# EAGLE design BrushTimer (EAGLE 6.1)
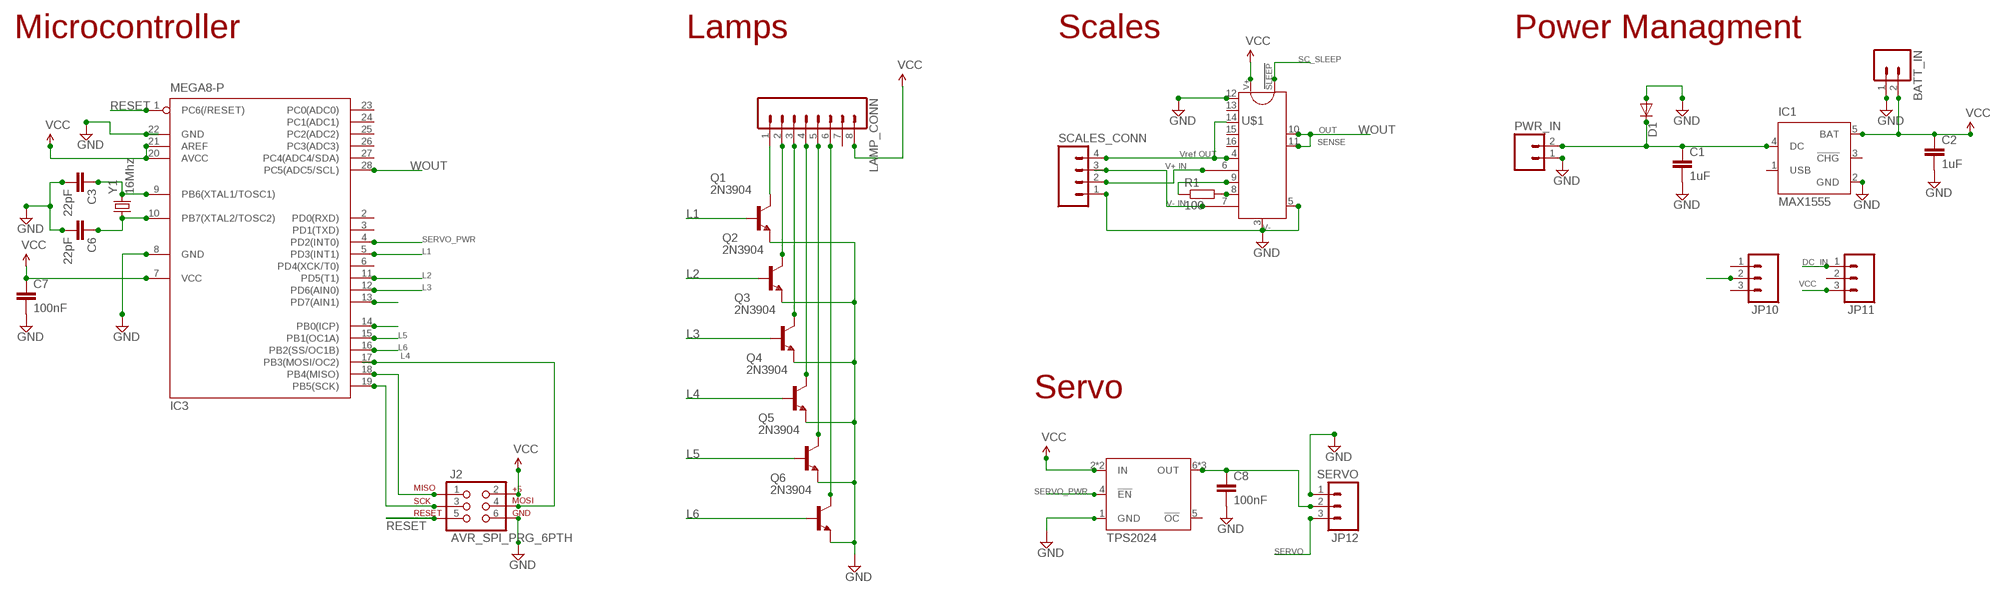
[diagram p0: schematic, sheet 1]

## Parts
BATT_IN  M02PTH  [1X02]
C1  1uF  CAP_  [AXIAL-5MM]
C2  1uF  CAP_  [AXIAL-5MM]
C3  22pF  C2.5/2  [C2.5-2]
C6  22pF  C2.5/2  [C2.5-2]
C7  100nF  C5/3.5  [C5B3.5]
C8  100nF  C5/3.5  [C5B3.5]
D1  DIODE-D-2.5  [D-2.5]
IC1  MAX1555  [SOT23-5L]
IC3  MEGA8-P  [DIL28-3]
J2  AVR_SPI_PRG_6PTH  [2X3]
JP10  M03PTH  [1X03]
JP11  M03PTH  [1X03]
JP12  SERVO  M03PTH  [1X03]
LAMP_CONN  M081X08  [1X08]
PWR_IN  M02PTH  [1X02]
Q1  2N3904  [TO92]
Q2  2N3904  [TO92]
Q3  2N3904  [TO92]
Q4  2N3904  [TO92]
Q5  2N3904  [TO92]
Q6  2N3904  [TO92]
R1  100  R-EU_0207/5V  [0207/5V]
SCALES_CONN  M04PTH  [1X04]
U$1  INA125  [DIL16]
U$2  TPS2024  [DIL08-OPTO]
Y1  16Mhz  CRYSTALHC49US  [HC49US]

## Nets
DC_IN: C1.P$1 D1.C IC1.4(DC) JP11.1 PWR_IN.2
GND: BATT_IN.1 C1.P$2 C2.P$2 C3.2 C6.2 C7.2 C8.2 D1.A IC1.2(GND) IC3.8(GND) IC3.22(GND) J2.6 JP10.2 JP12.1 PWR_IN.1 Q1.3(E) Q2.3(E) Q3.3(E) Q4.3(E) Q5.3(E) Q6.3(E) SCALES_CONN.1 U$1.3 U$1.5 U$1.12 U$2.1(GND)
L1: IC3.5(PD3(INT1)) Q1.2(B)
L1_OUT: LAMP_CONN.1 Q1.1(C)
L2: IC3.11(PD5(T1)) Q2.2(B)
L2_OUT: LAMP_CONN.2 Q2.1(C)
L3: IC3.12(PD6(AIN0)) Q3.2(B)
L3_OUT: LAMP_CONN.3 Q3.1(C)
L4: IC3.17(PB3(MOSI/OC2)) J2.4 Q4.2(B)
L4_OUT: LAMP_CONN.4 Q4.1(C)
L5: IC3.15(PB1(OC1A)) Q5.2(B)
L5_OUT: LAMP_CONN.5 Q5.1(C)
L6: IC3.16(PB2(SS/OC1B)) Q6.2(B)
L6_OUT: LAMP_CONN.6 Q6.1(C)
MISO: IC3.18(PB4(MISO)) J2.1
N$1: SCALES_CONN.2 U$1.6
RESET: IC3.1(PC6(/RESET)) J2.5
RG1: R1.1 U$1.9
RG2: R1.2 U$1.8
SC_SLEEP: IC3.13(PD7(AIN1)) U$1.2
SCK: IC3.19(PB5(SCK)) J2.3
SERVO: IC3.14(PB0(ICP)) JP12.3
SERVO_PWR: IC3.4(PD2(INT0)) U$2.4(!EN)
SERVO_VCC: C8.1 JP12.2 U$2.6(OUT) U$2.7(OUT) U$2.8(OUT)
V-IN: SCALES_CONN.3 U$1.7
VCC: BATT_IN.2 C2.P$1 C7.1 IC1.5(BAT) IC3.7(VCC) IC3.20(AVCC) IC3.21(AREF) J2.2 JP11.3 LAMP_CONN.8 U$1.1 U$2.2(IN) U$2.3(IN)
VREF-OUT: SCALES_CONN.4 U$1.4 U$1.14
WOUT: IC3.28(PC5(ADC5/SCL)) U$1.10 U$1.11
XTAL9: C3.1 IC3.9(PB6(XTAL1/TOSC1)) Y1.2
XTAL19: C6.1 IC3.10(PB7(XTAL2/TOSC2)) Y1.1
Unconnected: IC1.1(USB) IC1.3(!CHG) IC3.2(PD0(RXD)) IC3.3(PD1(TXD)) IC3.6(PD4(XCK/T0)) IC3.23(PC0(ADC0)) IC3.24(PC1(ADC1)) IC3.25(PC2(ADC2)) IC3.26(PC3(ADC3)) IC3.27(PC4(ADC4/SDA)) JP10.1 JP10.3 JP11.2 LAMP_CONN.7 U$1.13 U$1.15 U$1.16 U$2.5(!OC)

## Notes on the sheet
- Microcontroller | Lamps | Scales | Power Managment
- Servo

## Library data of the parts
BATT_IN PWR_IN = SparkFun:M02: Header 2 Standard 2-pin 0.1" header. Use with straight break away headers (SKU : PRT-00116), right angle break away headers (PRT-00553), swiss pins (PRT-00743), machine pins (PRT-00117), and female headers (PRT-00115). Molex polarized connector foot print use with SKU : PRT-08233 with associated crimp pins and housings.
C1 C2 = SparkFun:CAP: Capacitor Standard 0603 ceramic capacitor, and 0.1" leaded capacitor.
C3 C6-C8 = capacitor-wima:C: CAPACITOR naming: grid - package width
D1 = diode:DIODE-: DIODE
IC1 = maxim:MAX1555: Dual-Input USB/AC Adapter 1-Cell Li+ Battery Chargers Source: http://www.maxim-ic.com .. MAX1551-MAX1555.pdf; MF: MAXIM; MPN: MAX1555EZK+T; OC_FARNELL: 1628222; OC_NEWARK: 59J2761
IC3 = atmel:MEGA8-P: MICROCONTROLLER 8 Kbytes FLASH, 1 kbytes SRAM, 512 bytes EEPROM, USART, 4-channel 10 bit ADC, 2-channel 8 bit ADC Pin compatible with Atmega48, ATMega88, ATMega168 Source: avr.lbr; OC_FARNELL: unknown; OC_NEWARK: unknown
J2 = SparkFun:AVR_SPI_PRG_6: AVR ISP 6 Pin This is the reduced ISP connector for AVR programming. Common on Arduino. This footprint will take up less PCB space and can be used with a 10-pin to 6-pin adapter such as SKU: BOB-08508
JP10-JP12 = SparkFun:M03: Header 3 Standard 3-pin 0.1" header. Use with straight break away headers (SKU : PRT-00116), right angle break away headers (PRT-00553), swiss pins (PRT-00743), machine pins (PRT-00117), and female headers (PRT-00115). Molex polarized connector foot print use with SKU : PRT-08232 with associated crimp pins and housings.
LAMP_CONN = SparkFun:M08: Header 8 Standard 8-pin 0.1" header. Use with straight break away headers (SKU : PRT-00116), right angle break away headers (PRT-00553), swiss pins (PRT-00743), machine pins (PRT-00117), and female headers (PRT-00115).
Q1-Q6 = transistor-npn:2N3904: NPN Transistor
R1 = resistor:R-EU_: RESISTOR, European symbol
SCALES_CONN = SparkFun:M04: Header 4 Standard 4-pin 0.1" header. Use with straight break away headers (SKU : PRT-00116), right angle break away headers (PRT-00553), swiss pins (PRT-00743), machine pins (PRT-00117), and female headers (PRT-00115). Molex polarized connector foot print use with SKU : PRT-08231 with associated crimp pins and housings. 1MM SMD Version SKU: PRT-10208
U$1 = CustomLib:INA125: INSTRUMENTATION AMPLIFIER With Precision Voltage Reference
U$2 = texas-extra:TPS2024
Y1 = SparkFun:CRYSTAL: Crystals Various standard crystals. Proven footprints. Spark Fun Electronics SKU : COM-00534

## Board
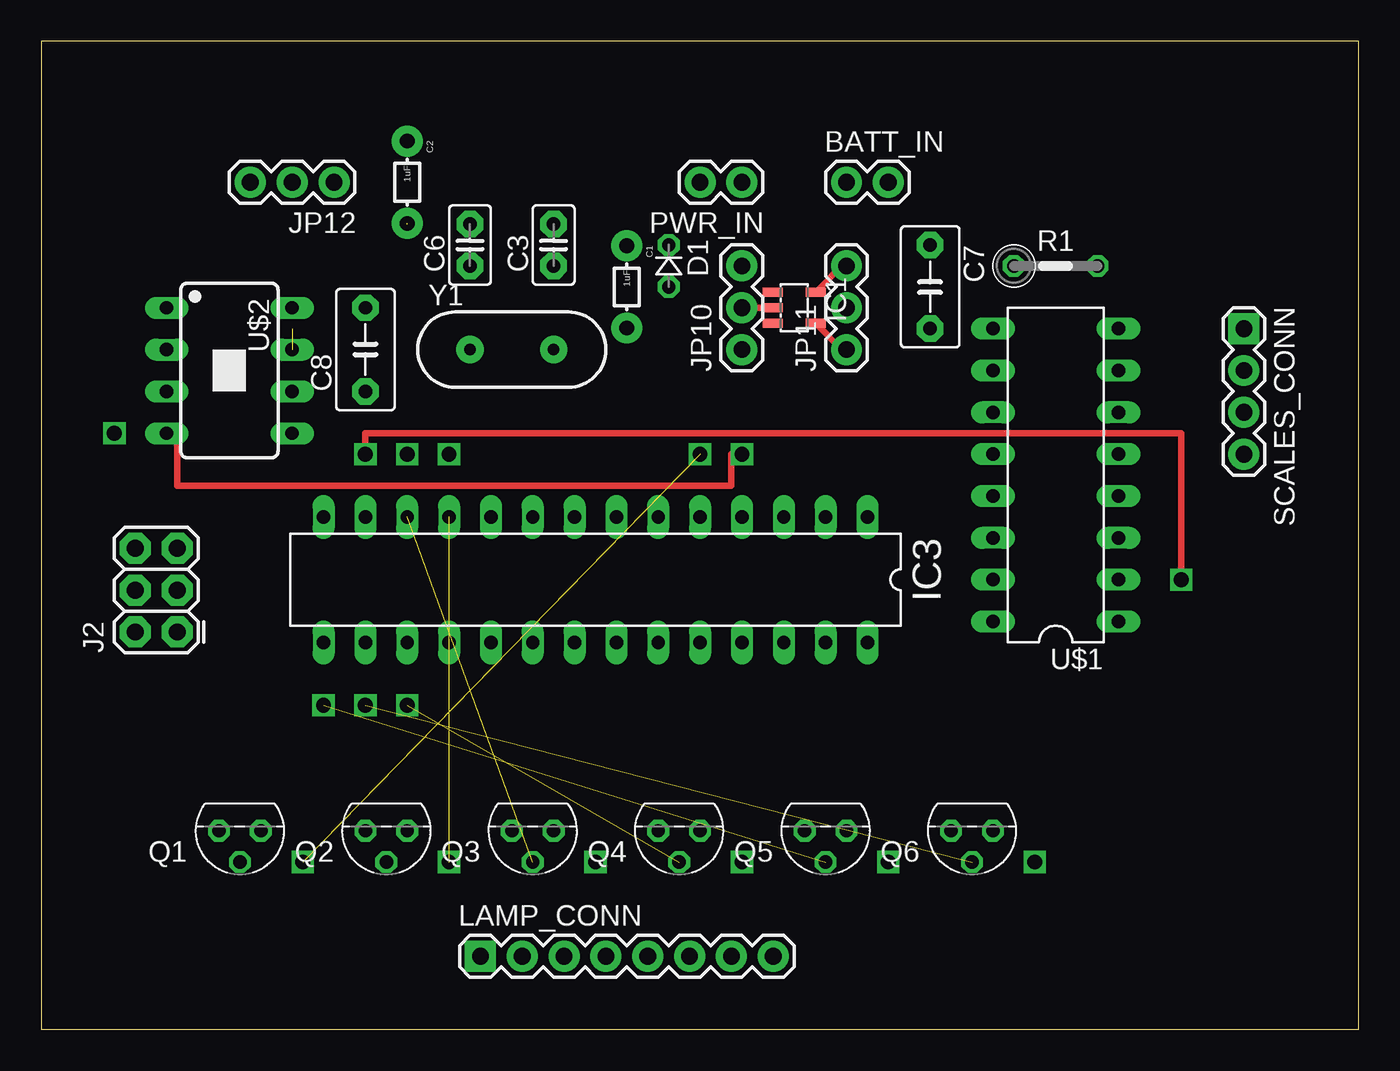
[diagram p1: board, top side]
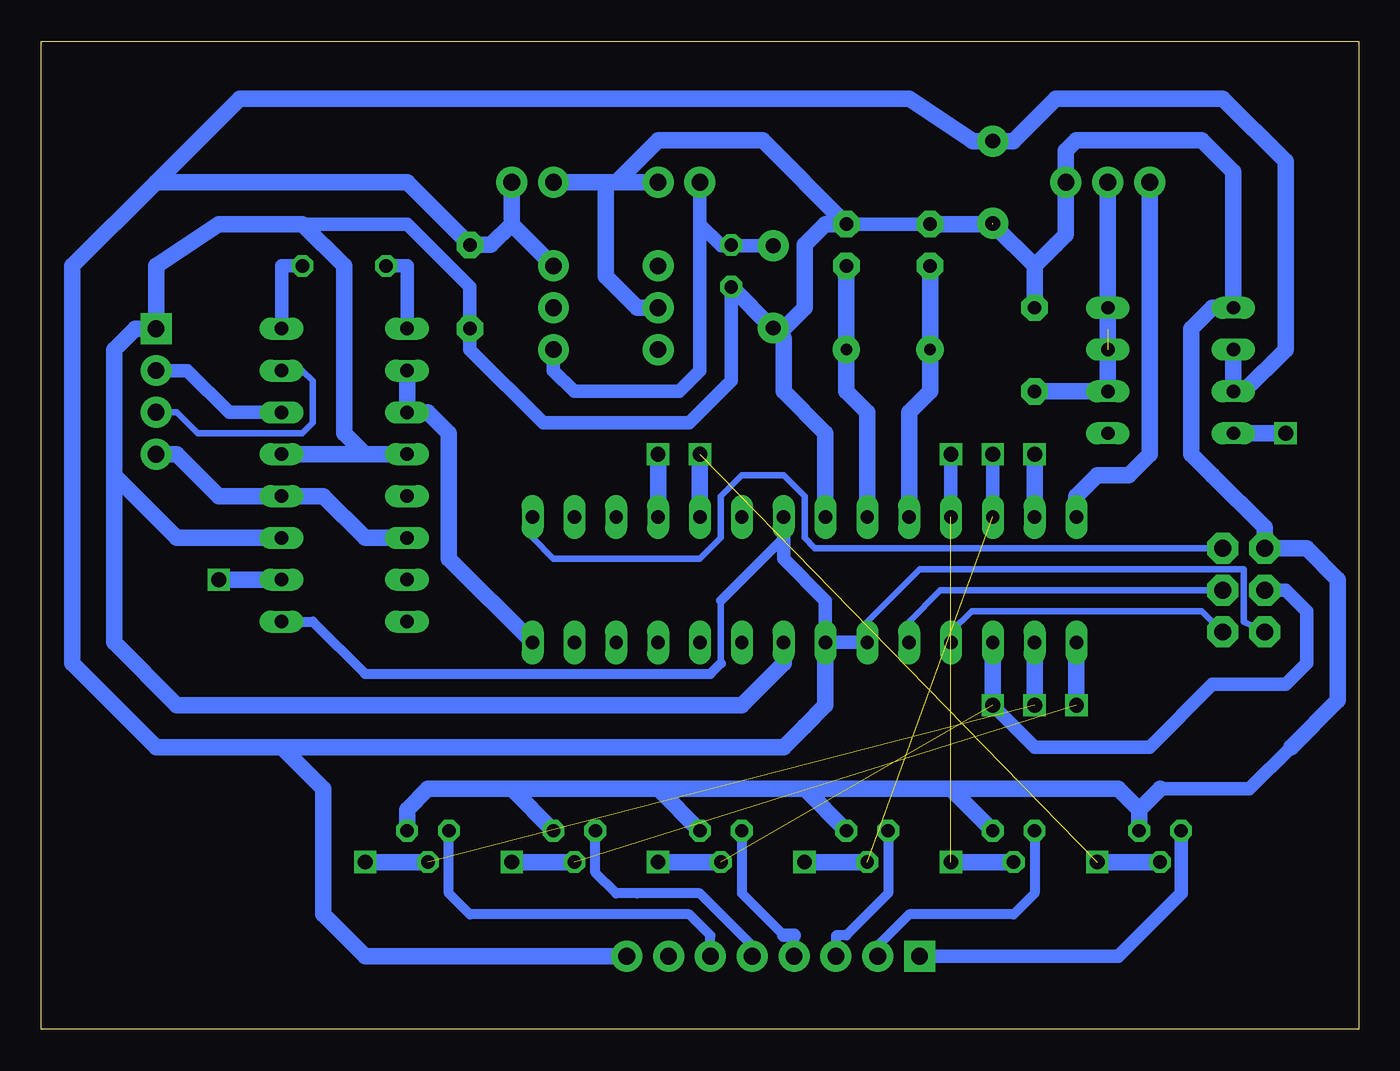
[diagram p2: board, bottom side, seen from below]

Size 80 x 60 mm. Coordinates in mm from the lower left corner, seen from the top.
Outline: 0,0 80,0 80,60 0,60 0,0
Copper layers (1*16): Top 0.035mm / dielectric 1.5mm / Bottom 0.035mm
Design rules: minimum track width 10mil, minimum drill 24mil, track to track 8mil, track to pad 8mil, pad to pad 8mil, via to via 8mil, smd to smd 8mil, copper to edge 40mil, drill to drill 8mil, minimum pad ring 10mil, minimum via ring 8mil, stop-mask expansion 4mil, vias tented up to drill 0mil, thermal gap 10mil

### Footprints (pad centres in the part's own frame; a part is rotated, then mirrored left to right if it is on the bottom)
1X02 = drill 1.016 pad 1.88: 1 0,0; 2 2.54,0
AXIAL-5MM = drill 0.9 pad 1.88: P$1 -2.5,0; P$2 2.5,0
C2.5-2 = drill 0.813 pad 1.6 octagon: 1 -1.27,0; 2 1.27,0
C5B3.5 = drill 0.813 pad 1.6 octagon: 1 -2.54,0; 2 2.54,0
D-2.5 = drill 0.813 octagon: A 1.27,0; C -1.27,0
SOT23-5L = smd 0.55 x 1.2: 1 -0.95,-1.3; 2 0,-1.3; 3 0.95,-1.3; 4 0.95,1.3; 5 -0.95,1.3
DIL28-3 = drill 0.813 long: 1 -16.51,-3.81; 2 -13.97,-3.81; 3 -11.43,-3.81; 4 -8.89,-3.81; 5 -6.35,-3.81; 6 -3.81,-3.81; 7 -1.27,-3.81; 8 1.27,-3.81; 9 3.81,-3.81; 10 6.35,-3.81; 11 8.89,-3.81; 12 11.43,-3.81; 13 13.97,-3.81; 14 16.51,-3.81; 15 16.51,3.81; 16 13.97,3.81; 17 11.43,3.81; 18 8.89,3.81; 19 6.35,3.81; 20 3.81,3.81; 21 1.27,3.81; 22 -1.27,3.81; 23 -3.81,3.81; 24 -6.35,3.81; 25 -8.89,3.81; 26 -11.43,3.81; 27 -13.97,3.81; 28 -16.51,3.81
2X3 = drill 1.016 pad 1.88 octagon: 1 0,0; 2 0,2.54; 3 2.54,0; 4 2.54,2.54; 5 5.08,0; 6 5.08,2.54
1X03 = drill 1.016 pad 1.88: 1 0,0; 2 2.54,0; 3 5.08,0
1X08 = drill 1.016 pad 1.88 square: 1 0,0 | drill 1.016 pad 1.88: 2 2.54,0; 3 5.08,0; 4 7.62,0; 5 10.16,0; 6 12.7,0; 7 15.24,0; 8 17.78,0
TO92 = drill 0.813 octagon: 1 1.27,0; 2 0,1.905; 3 -1.27,0
0207/5V = drill 0.813 octagon: 1 -2.54,0; 2 2.54,0
1X04 = drill 1.016 pad 1.88 square: 1 0,0 | drill 1.016 pad 1.88: 2 2.54,0; 3 5.08,0; 4 7.62,0
DIL16 = drill 0.813 long: 1 -8.89,-3.81; 2 -6.35,-3.81; 3 -3.81,-3.81; 4 -1.27,-3.81; 5 1.27,-3.81; 6 3.81,-3.81; 7 6.35,-3.81; 8 8.89,-3.81; 9 8.89,3.81; 10 6.35,3.81; 11 3.81,3.81; 12 1.27,3.81; 13 -1.27,3.81; 14 -3.81,3.81; 15 -6.35,3.81; 16 -8.89,3.81
DIL08-OPTO = drill 0.813 long: 1 -3.81,-3.81; 2 -1.27,-3.81; 3 1.27,-3.81; 4 3.81,-3.81; 5 3.81,3.81; 6 1.27,3.81; 7 -1.27,3.81; 8 -3.81,3.81
HC49US = drill 0.7 pad 1.651: 1 -2.54,0; 2 2.54,0

### Placement (x,y rotation side)
BATT_IN  48.9,51.44 0 top
C1  35.56,45.09 270 top
C2  22.23,51.44 270 top
C3  31.11,47.62 90 top
C6  26.04,47.62 90 top
C7  53.98,45.09 270 top
C8  19.68,41.27 90 top
D1  38.1,46.35 270 top
IC1  45.72,43.81 270 top
IC3  33.66,27.3 180 top
J2  8.26,24.13 90 top
JP10  42.55,41.27 90 top
JP11  48.9,41.27 90 top
JP12  17.78,51.44 180 top
LAMP_CONN  26.67,4.45 0 top
PWR_IN  42.55,51.44 180 top
Q1  12.06,12.06 180 top
Q2  20.95,12.06 180 top
Q3  29.84,12.06 180 top
Q4  38.73,12.06 180 top
Q5  47.62,12.06 180 top
Q6  56.52,12.06 180 top
R1  61.59,46.35 0 top
SCALES_CONN  73.03,42.55 270 top
U$1  61.59,33.66 90 top
U$2  11.43,40.01 270 top
Y1  28.57,41.27 0 top

### Tracks (layer width: path | path; a pad name or v marks a point on that pad's centre or on a via)
DC_IN
  Top 0.406: IC1.4 48.61,41.27 JP11.1
  Bottom 0.813: PWR_IN.2 40.01,50.16 40.01,48.9 | 40.01,48.9 40.01,40.01 41.27,38.73 46.35,38.73 47.62,38.73 48.9,40.01 JP11.1 | C1.P$1 38.7,47.59 40.01,48.9 | D1.C 38.73,47.62 40.01,48.9
GND  (1 unrouted)
  Top 0.254: 17.14,51.44 JP12.1
  Top 0.406: IC1.2 JP10.2
  Bottom 0.813: 60.33,34.92 61.59,34.92 U$1.5 | C3.2 C6.2 | C1.P$2 35.6,42.59 | 64.14,48.9 57.78,48.9 53.98,45.09 C7.2 53.98,41.27 49.53,36.83 40.64,36.83 40.01,37.47 38.1,39.37 D1.A | 12.06,14.61 6.65,14.61 4.11,17.14
  Bottom 1.016: U$1.12 60.33,34.92 | U$1.5 61.59,34.92 60.33,34.92 | 60.33,34.92 61.59,36.2 61.59,46.35 64.14,48.9 69.22,48.9 73.03,46.35 SCALES_CONN.1 74.3,42.55 75.56,41.27 75.56,33.66 | U$1.3 71.75,29.84 75.56,33.66 | IC3.22 34.92,22.23 37.47,19.68 71.75,19.68 75.56,23.5 75.56,33.66 | 45.72,51.44 46.35,51.44 | 46.35,51.44 BATT_IN.1 46.35,51.44 | 46.35,51.44 45.72,51.44 | 45.72,51.44 45.72,45.72 43.81,43.81 JP10.2 | C6.2 22.23,48.9 19.68,46.35 | 19.68,46.35 C8.2 19.68,46.35 | 19.68,46.35 18.41,47.62 17.78,48.26 JP12.1 17.78,53.34 17.14,53.98 9.53,53.98 7.62,52.07 U$2.1 8.89,43.81 10.16,42.55 10.16,34.92 8.89,33.66 5.71,30.48 J2.6 3.17,29.21 1.27,27.3 1.27,19.98 4.11,17.14 | IC3.8 32.38,36.2 34.92,38.73 34.92,41.95 C1.P$2 34.88,42.59 33.66,43.81 33.66,47.62 32.38,48.9 C3.2 36.2,53.98 37.47,53.98 42.55,53.98 45.09,51.44 | 35.6,42.59 D1.A | PWR_IN.1 45.09,51.44 | 45.09,51.44 46.35,51.44 | Q6.3 57.78,13.34 56.52,14.61 51.44,14.61 | 51.44,14.61 42.55,14.61 | 42.55,14.61 33.66,14.61 | 33.66,14.61 24.77,14.61 | 24.77,14.61 15.88,14.61 14.61,14.61 13.34,13.34 | 13.34,13.34 Q1.3 13.34,13.34 | Q5.3 51.44,14.61 | Q4.3 42.55,14.61 | Q2.3 24.77,14.61 | 13.34,13.34 12.06,14.61 | Q3.3 33.66,14.61
L1  (via drill 0.9)  (1 unrouted)
  Bottom 1.016: Q1.2 v15.88,10.16 | IC3.5 v40.01,34.92
L1_OUT
  Bottom 0.813: Q1.1 10.79,8.26 14.61,4.45 LAMP_CONN.1
L2  (via drill 0.9)  (1 unrouted)
  Bottom 0.813: IC3.11 v24.77,34.92
  Bottom 1.016: Q2.2 v24.77,10.16
L2_OUT
  Bottom 0.61: LAMP_CONN.2 29.21,5.08 27.3,6.99 20.95,6.99 19.68,8.26 Q2.1
L3  (via drill 0.9)  (1 unrouted)
  Bottom 0.813: IC3.12 v22.23,34.92
  Bottom 1.016: Q3.2 v33.66,10.16
L3_OUT
  Bottom 0.61: Q3.1 28.57,8.26 31.11,5.71 31.75,5.71 LAMP_CONN.3
L4  (via drill 0.9)  (1 unrouted)
  Bottom 0.813: J2.4 4.45,26.67 3.17,25.4 3.17,22.23 4.45,20.95 8.89,20.95 12.7,17.14 14.61,17.14 19.68,17.14 v22.23,19.68
  Bottom 1.016: Q4.2 v42.55,10.16 | IC3.17 v22.23,19.68
L4_OUT
  Bottom 0.61: Q4.1 37.47,8.26 34.92,5.71 | 34.29,5.71 LAMP_CONN.4
  Bottom 0.813: 34.92,5.71 34.29,5.71
L5  (via drill 0.9)  (1 unrouted)
  Bottom 1.016: Q5.2 v51.44,10.16 | IC3.15 v17.14,19.68
L5_OUT
  Bottom 0.61: LAMP_CONN.5 36.83,5.08 40.01,8.26 43.81,8.26 45.09,8.26 46.35,9.53 Q5.1
L6  (via drill 0.9)  (1 unrouted)
  Bottom 1.016: Q6.2 v60.33,10.16 | IC3.16 v19.68,19.68
L6_OUT
  Bottom 0.61: LAMP_CONN.6 39.37,5.71 40.64,6.99 53.98,6.99 55.24,8.26 Q6.1
MISO
  Bottom 0.406: J2.1 9.53,25.4 10.16,25.4 23.5,25.4 24.77,24.13 IC3.18
N$1
  Bottom 0.813: U$1.6 68.58,37.47 71.12,40.01 SCALES_CONN.2
RESET
  Bottom 0.406: J2.5 9.53,29.21 10.16,29.21 33.02,29.21 33.66,29.84 33.66,32.38 34.92,33.66 37.47,33.66 38.73,32.38 38.73,29.84 40.01,28.57 48.9,28.57 50.16,29.84 IC3.1
RG1
  Bottom 0.813: U$1.9 57.78,46.35 R1.1
RG2
  Bottom 0.813: U$1.8 65.41,46.35 R1.2
SC_SLEEP  (via drill 0.9)
  Top 0.406: v19.68,34.92 19.68,36.2 62.87,36.2 69.22,36.2 v69.22,27.3
  Bottom 1.016: U$1.2 v69.22,27.3 | IC3.13 v19.68,34.92
SCK
  Bottom 0.406: J2.3 24.13,26.67 25.4,26.67 27.3,24.77 IC3.19
SERVO
  Bottom 1.016: JP12.3 12.7,34.92 13.97,33.66 15.88,33.66 17.14,32.38 IC3.14
SERVO_PWR  (via drill 0.9)
  Top 0.406: U$2.4 8.26,35.56 8.26,33.66 8.26,33.02 41.91,33.02 41.91,34.92 v42.55,34.92
  Bottom 1.016: U$2.4 v4.45,36.2 | IC3.4 v42.55,34.92
SERVO_VCC  (1 unrouted)
  Top 0.254: 15.88,51.44 JP12.2
  Bottom 1.016: U$2.8 15.24,42.55 | 15.24,42.55 U$2.6 C8.1 | JP12.2 15.24,42.55
V-IN
  Bottom 0.406: U$1.7 64.14,40.01 63.5,39.37 63.5,36.83 64.14,36.2 70.48,36.2 71.75,37.47 SCALES_CONN.3
VCC
  Top 0.406: IC1.5 48.61,46.35 JP11.3
  Bottom 0.406: 38.73,22.23 38.73,26.04 | J2.2 6.99,24.77 6.99,26.67 6.99,27.94 8.89,27.94 10.16,27.94 26.67,27.94 29.84,24.77 IC3.20
  Bottom 0.61: U$1.1 63.5,24.77 60.33,21.59 40.01,21.59 39.37,21.59 38.73,22.23 | 38.73,26.04 34.92,29.84
  Bottom 0.813: IC3.20 IC3.21 32.38,26.04 34.92,28.57 34.92,29.84 IC3.7
  Bottom 1.016: IC3.21 32.38,19.68 33.66,18.41 34.92,17.14 57.78,17.14 | 57.78,17.14 66.67,17.14 | 66.67,17.14 73.03,17.14 | 73.03,17.14 66.67,17.14 | 66.67,17.14 65.41,17.14 62.87,14.61 62.87,8.26 62.87,6.99 60.33,4.45 LAMP_CONN.8 | BATT_IN.2 51.44,48.9 | 51.44,48.9 JP11.3 | 51.44,48.9 52.7,47.62 C7.1 57.78,51.44 73.03,51.44 | 57.78,17.14 66.67,17.14 | 66.67,17.14 73.03,17.14 | 73.03,17.14 78.11,22.23 78.11,46.35 73.03,51.44 | U$2.2 U$2.3 6.99,38.73 4.45,41.27 4.45,52.7 8.26,56.52 17.14,56.52 18.41,56.52 21,53.94 C2.P$1 23.45,53.94 23.5,53.98 27.3,56.52 67.94,56.52 73.03,51.44
VREF-OUT
  Bottom 1.016: SCALES_CONN.4 71.75,34.92 69.22,32.38 U$1.4 62.87,32.38 60.33,29.84 U$1.14
WOUT
  Bottom 0.813: 56.52,37.47 U$1.11
  Bottom 1.016: U$1.10 U$1.11 | IC3.28 55.24,28.57 55.24,34.92 55.24,36.2 56.52,37.47
XTAL9
  Bottom 1.016: IC3.9 29.84,37.47 31.11,38.73 Y1.2 C3.1
XTAL19
  Bottom 1.016: IC3.10 27.3,37.47 26.04,38.73 Y1.1 C6.1